# Altium schematic sheet IMX7S_PMIC.SchDoc
size A3
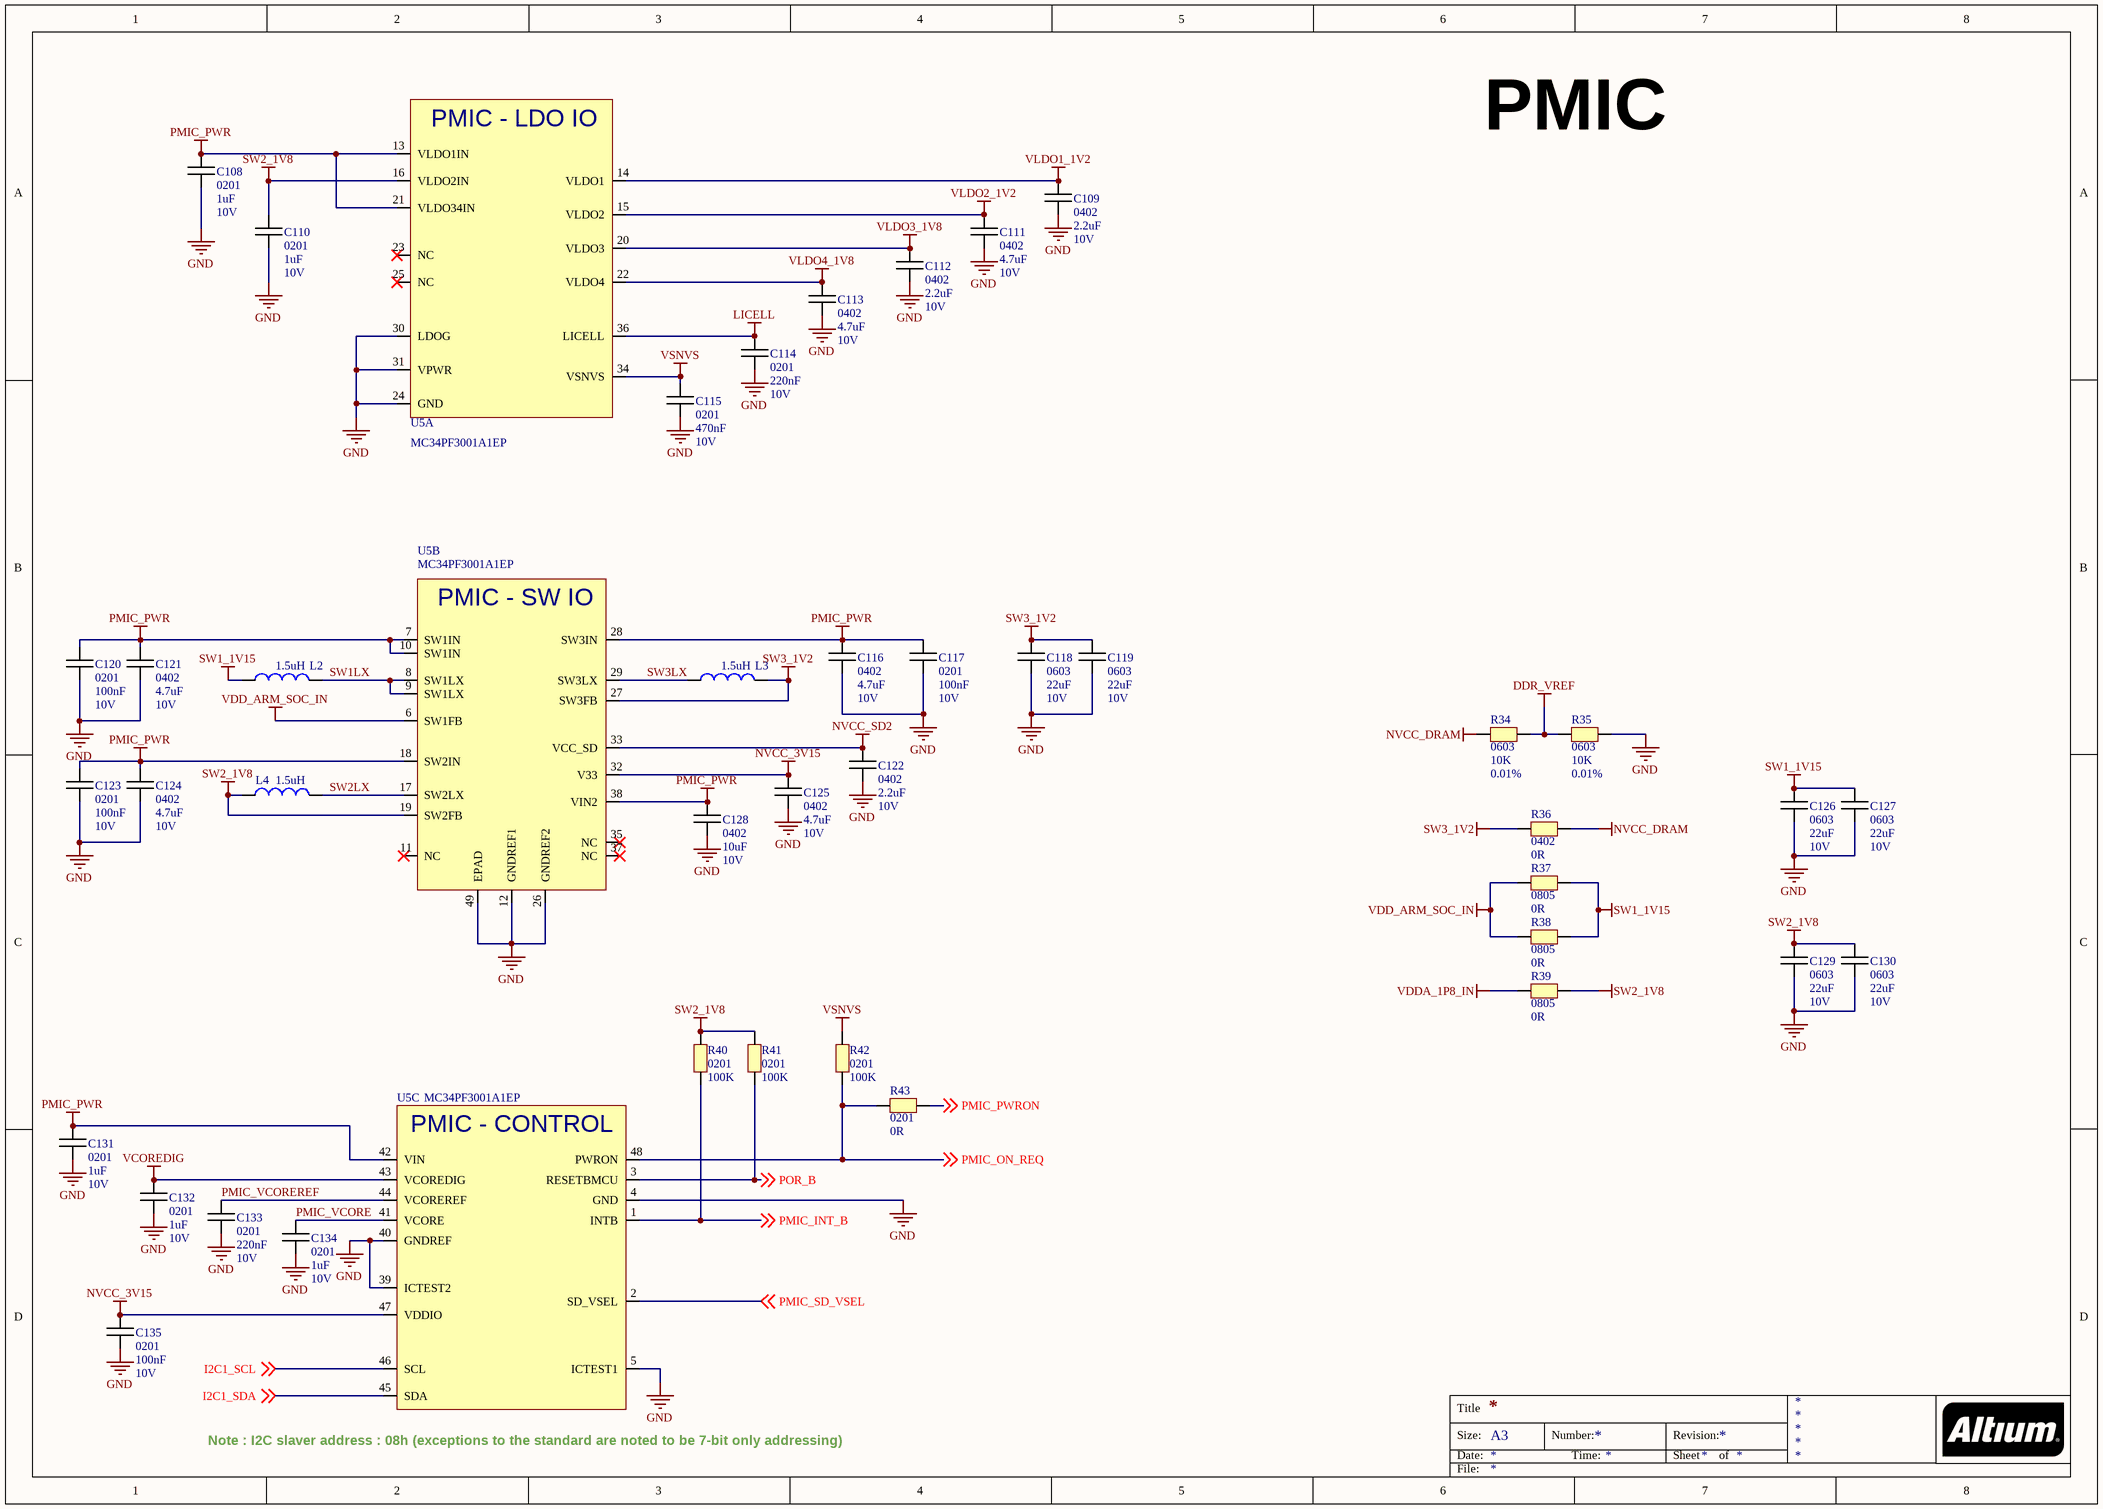
[diagram p0: IMX7S_PMIC.SchDoc]

## Parts
C108  value 1uF  PACKAGE: 0201  VOLTAGE: 10V  [C0201]  (hidden comment: C0201)
C109  value 2.2uF  PACKAGE: 0402  VOLTAGE: 10V  [C0402]  (hidden comment: C0402)
C110  value 1uF  PACKAGE: 0201  VOLTAGE: 10V  [C0201]  (hidden comment: C0201)
C111  value 4.7uF  PACKAGE: 0402  VOLTAGE: 10V  [C0402]  (hidden comment: C0402)
C112  value 2.2uF  PACKAGE: 0402  VOLTAGE: 10V  [C0402]  (hidden comment: C0402)
C113  value 4.7uF  PACKAGE: 0402  VOLTAGE: 10V  [C0402]  (hidden comment: C0402)
C114  value 220nF  PACKAGE: 0201  VOLTAGE: 10V  [C0201]  (hidden comment: C0201)
C115  value 470nF  PACKAGE: 0201  VOLTAGE: 10V  [C0201]  (hidden comment: C0201)
C116  value 4.7uF  PACKAGE: 0402  VOLTAGE: 10V  [C0402]  (hidden comment: C0402)
C117  value 100nF  PACKAGE: 0201  VOLTAGE: 10V  [C0201]  (hidden comment: C0201)
C118  value 22uF  PACKAGE: 0603  VOLTAGE: 10V  [C0603]  (hidden comment: C0603)
C119  value 22uF  PACKAGE: 0603  VOLTAGE: 10V  [C0603]  (hidden comment: C0603)
C120  value 100nF  PACKAGE: 0201  VOLTAGE: 10V  [C0201]  (hidden comment: C0201)
C121  value 4.7uF  PACKAGE: 0402  VOLTAGE: 10V  [C0402]  (hidden comment: C0402)
C122  value 2.2uF  PACKAGE: 0402  VOLTAGE: 10V  [C0402]  (hidden comment: C0402)
C123  value 100nF  PACKAGE: 0201  VOLTAGE: 10V  [C0201]  (hidden comment: C0201)
C124  value 4.7uF  PACKAGE: 0402  VOLTAGE: 10V  [C0402]  (hidden comment: C0402)
C125  value 4.7uF  PACKAGE: 0402  VOLTAGE: 10V  [C0402]  (hidden comment: C0402)
C126  value 22uF  PACKAGE: 0603  VOLTAGE: 10V  [C0603]  (hidden comment: C0603)
C127  value 22uF  PACKAGE: 0603  VOLTAGE: 10V  [C0603]  (hidden comment: C0603)
C128  value 10uF  PACKAGE: 0402  VOLTAGE: 10V  [C0402]  (hidden comment: C0402)
C129  value 22uF  PACKAGE: 0603  VOLTAGE: 10V  [C0603]  (hidden comment: C0603)
C130  value 22uF  PACKAGE: 0603  VOLTAGE: 10V  [C0603]  (hidden comment: C0603)
C131  value 1uF  PACKAGE: 0201  VOLTAGE: 10V  [C0201]  (hidden comment: C0201)
C132  value 1uF  PACKAGE: 0201  VOLTAGE: 10V  [C0201]  (hidden comment: C0201)
C133  value 220nF  PACKAGE: 0201  VOLTAGE: 10V  [C0201]  (hidden comment: C0201)
C134  value 1uF  PACKAGE: 0201  VOLTAGE: 10V  [C0201]  (hidden comment: C0201)
C135  value 100nF  PACKAGE: 0201  VOLTAGE: 10V  [C0201]  (hidden comment: C0201)
L2  value 1.5uH  [SELF]  (hidden comment: Self)
L3  value 1.5uH  [SELF]  (hidden comment: Self)
L4  value 1.5uH  [SELF]  (hidden comment: Self)
R34  value 10K  PACKAGE: 0603  VOLTAGE: 0.01%  [R0603]  (hidden comment: R0603)
R35  value 10K  PACKAGE: 0603  VOLTAGE: 0.01%  [R0603]  (hidden comment: R0603)
R36  value 0R  PACKAGE: 0402  [R0402]  (hidden comment: R0402)
R37  value 0R  PACKAGE: 0805  [R0805]  (hidden comment: R0805)
R38  value 0R  PACKAGE: 0805  [R0805]  (hidden comment: R0805)
R39  value 0R  PACKAGE: 0805  [R0805]  (hidden comment: R0805)
R40  value 100K  PACKAGE: 0201  [R0201]  (hidden comment: R0201)
R41  value 100K  PACKAGE: 0201  [R0201]  (hidden comment: R0201)
R42  value 100K  PACKAGE: 0201  [R0201]  (hidden comment: R0201)
R43  value 0R  PACKAGE: 0201  [R0201]  (hidden comment: R0201)
U5  MC34PF3001A1EP  [QFN48]  (parts A,B,C of 3)

## Nets
DDR_VREF: R34.2 R35.1
GND: C108.1 C109.1 C110.1 C111.1 C112.1 C113.1 C114.1 C115.1 C116.1 C117.1 C118.1 C119.1 C120.1 C121.1 C122.1 C123.1 C124.1 C125.1 C126.1 C127.1 C128.1 C129.1 C130.1 C131.1 C132.1 C133.1 C134.1 C135.1 R35.2 U5.4(GND) U5.5(ICTEST1) U5.12(GNDREF1) U5.24(GND) U5.26(GNDREF2) U5.30(LDOG) U5.31(VPWR) U5.39(ICTEST2) U5.40(GNDREF) U5.49(EPAD)
LICELL: C114.2 U5.36(LICELL)
NVCC_3V15: C125.2 C135.2 U5.32(V33) U5.47(VDDIO)
NVCC_DRAM: R34.1 R36.2
NVCC_SD2: C122.2 U5.33(VCC_SD)
PMIC_PWR: C108.2 C116.2 C117.2 C120.2 C121.2 C123.2 C124.2 C128.2 C131.2 U5.7(SW1IN) U5.10(SW1IN) U5.13(VLDO1IN) U5.18(SW2IN) U5.21(VLDO34IN) U5.28(SW3IN) U5.38(VIN2) U5.42(VIN)
SW1_1V15: C126.2 C127.2 L2.1 R37.2 R38.2
SW2_1V8: C110.2 C129.2 C130.2 L4.1 R39.2 R40.2 R41.2 U5.16(VLDO2IN) U5.19(SW2FB)
SW3_1V2: C118.2 C119.2 L3.2 R36.1 U5.27(SW3FB)
VCOREDIG: C132.2 U5.43(VCOREDIG)
VDD_ARM_SOC_IN: R37.1 R38.1 U5.6(SW1FB)
VDDA_1P8_IN: R39.1
VLDO1_1V2: C109.2 U5.14(VLDO1)
VLDO2_1V2: C111.2 U5.15(VLDO2)
VLDO3_1V8: C112.2 U5.20(VLDO3)
VLDO4_1V8: C113.2 U5.22(VLDO4)
VSNVS: C115.2 R42.2 U5.34(VSNVS)
I2C1_SCL: U5.46(SCL) ; off-sheet I2C1_SCL
I2C1_SDA: U5.45(SDA) ; off-sheet I2C1_SDA
PMIC_INT_B: R40.1 U5.1(INTB) ; off-sheet PMIC_INT_B
PMIC_ON_REQ: R42.1 R43.2 U5.48(PWRON) ; off-sheet PMIC_ON_REQ
PMIC_PWRON: R43.1 ; off-sheet PMIC_PWRON
PMIC_SD_VSEL: U5.2(SD_VSEL) ; off-sheet PMIC_SD_VSEL
PMIC_VCORE: C134.2 U5.41(VCORE)
PMIC_VCOREREF: C133.2 U5.44(VCOREREF)
POR_B: R41.1 U5.3(RESETBMCU) ; off-sheet POR_B
SW1LX: L2.2 U5.8(SW1LX) U5.9(SW1LX)
SW2LX: L4.2 U5.17(SW2LX)
SW3LX: L3.1 U5.29(SW3LX)

Not connected (* = marked no-connect by the designer): U5 11(NC)* 23(NC)* 25(NC)* 35(NC)* 37(NC)*

## Notes on the sheet
- PMIC
- (near U5) Note : I2C slaver address : 08h (exceptions to the standard are noted to be 7-bit only addressing)
- Title
- Size:
- Date:
- A3
- Number:
- Time:
- Revision:
- Sheet
- of
- File:
- (in symbol MC34PF3001A1EP, part A) PMIC - LDO IO
- (in symbol MC34PF3001A1EP, part B) PMIC - SW IO
- (in symbol MC34PF3001A1EP, part C) PMIC - CONTROL

## Library data of the parts
C108 C110 C131 C132 C134 = C0201: Manufacturer 1: Murata; Manufacturer Part Number 1: GRM033R60J105MEA2D; Description: CAP CER 1UF 6.3V X5R 0201; Tolerance: 20%; Voltage Rating: 6.3V; Dielectric: X5R; Supplier 1: Farnell; Supplier Part Number 1: 2666353; Stock 1: 165000; Pricing 1: 15000=0,01430, 75000=0,01240 (EUR); RoHS: Yes; Mount: Surface Mount; Case/Package: 0201; Weight: 1.2E-05oz; Case Code (Imperial): 0201; Case Code (Metric): 0603; Min Operating Temperature: -55°C; Max Operating Temperature: 85°C; Package Quantity: 1; Packaging: Cut Tape; Capacitance: 1uF; Voltage Rating (DC): 6.3V; Termination: SMD/SMT; Length: 0.6mm; Height: 0.3mm; Width: 0.3mm; Depth: 0.3mm; Thickness: 300um; REACH SVHC: No SVHC; Lead Free: Lead Free; ComponentLink1URL: https://datasheet.ciiva.com/18699/grm033r60j105mea2-02-18699520.pdf?src-supplier=Digi-Key; ComponentLink1Description: https://datasheet.ciiva.com/18699/grm033r60j105mea2-02-18699520.pdf?src-supplier=Digi-Key; ComponentLink2URL: https://datasheet.ciiva.com/24218/c02e-24218376.pdf?src-supplier=Mouser; ComponentLink2Description: https://datasheet.ciiva.com/24218/c02e-24218376.pdf?src-supplier=Mouser; ComponentLink3URL: https://datasheet.ciiva.com/18699/partnumbering-e-01-18699519.pdf?src-supplier=Digi-Key; ComponentLink3Description: https://datasheet.ciiva.com/18699/partnumbering-e-01-18699519.pdf?src-supplier=Digi-Key
C109 C112 C122 = C0402: Manufacturer 1: Wurth Electronics; Manufacturer Part Number 1: 885012105013; Tolerance: 20%; Supplier 1: Farnell; Supplier Part Number 1: 2533930; Stock 1: 11802; Pricing 1: 10=0,21600, 100=0,14100, 500=0,10600, 2500=0,09320, 5000=0,07880, 10000=0,07420, 50000=0,06950 (EUR); RoHS: Yes; Mount: Surface Mount; Case/Package: 0402; Case Code (Metric): 1005; Case Code (Imperial): 0402; Min Operating Temperature: -55°C; Max Operating Temperature: 85°C; Packaging: Tape and Reel; Capacitance: 2.2uF; Voltage Rating: 10V; Length: 0.039inch; Width: 0.02inch; Thickness: 0.022inch; ComponentLink1URL: http://www.farnell.com/datasheets/2031748.pdf?src-supplier=Farnell; ComponentLink1Description: http://www.farnell.com/datasheets/2031748.pdf?src-supplier=Farnell; ComponentLink2URL: https://katalog.we-online.de/pbs/datasheet/885012105013.pdf?src-supplier=Digi-Key; ComponentLink2Description: https://katalog.we-online.de/pbs/datasheet/885012105013.pdf?src-supplier=Digi-Key
C111 C113 C116 C121 C124 C125 = C0402: Manufacturer 1: Murata; Manufacturer Part Number 1: GRM155R61A475MEAAD; Supplier 1: Farnell; Supplier Part Number 1: 2688503; Stock 1: 566816; Pricing 1: 10=0,19300, 100=0,08330, 500=0,05910, 2500=0,04130, 5000=0,03540, 10000=0,02750, 50000=0,02700 (EUR); Case/Package: 0402; ComponentLink1URL: http://www.farnell.com/datasheets/2189109.pdf?src-supplier=Farnell; ComponentLink1Description: http://www.farnell.com/datasheets/2189109.pdf?src-supplier=Farnell; ComponentLink2URL: https://search.murata.co.jp/Ceramy/image/img/A01X/G101/ENG/GRM155R61A475MEAA-01.pdf?src-supplier=Digi-Key; ComponentLink2Description: https://search.murata.co.jp/Ceramy/image/img/A01X/G101/ENG/GRM155R61A475MEAA-01.pdf?src-supplier=Digi-Key; ComponentLink3URL: http://datasheet.octopart.com/GRM155R61A475MEAAD-Murata-datasheet-68589269.pdf?src-supplier=Newark; ComponentLink3Description: http://datasheet.octopart.com/GRM155R61A475MEAAD-Murata-datasheet-68589269.pdf?src-supplier=Newark; ComponentLink4URL: http://datasheet.octopart.com/GRM155R61A475MEAAD-Murata-datasheet-8819587.pdf; ComponentLink4Description: http://datasheet.octopart.com/GRM155R61A475MEAAD-Murata-datasheet-8819587.pdf; ComponentLink5URL: http://datasheet.octopart.com/GRM155R61A475MEAAD-Murata-datasheet-10025737.pdf; ComponentLink5Description: http://datasheet.octopart.com/GRM155R61A475MEAAD-Murata-datasheet-10025737.pdf; ComponentLink6URL: http://datasheet.octopart.com/GRM155R61A475MEAAD-Murata-datasheet-11978611.pdf; ComponentLink6Description: http://datasheet.octopart.com/GRM155R61A475MEAAD-Murata-datasheet-11978611.pdf; ComponentLink7URL: http://datasheet.octopart.com/GRM155R61A475MEAAD-Murata-datasheet-12510076.pdf; ComponentLink7Description: http://datasheet.octopart.com/GRM155R61A475MEAAD-Murata-datasheet-12510076.pdf; ComponentLink8URL: http://datasheet.octopart.com/GRM155R61A475MEAAD-Murata-datasheet-12515295.pdf; ComponentLink8Description: http://datasheet.octopart.com/GRM155R61A475MEAAD-Murata-datasheet-12515295.pdf
C114 C133 = C0201: Manufacturer 1: Murata; Manufacturer Part Number 1: GRM033R61A224KE90D; Tolerance: 10%; Dielectric: X5R; Supplier 1: Farnell; Supplier Part Number 1: 2990687; Stock 1: 4290; Pricing 1: 10=0,04270, 100=0,02370, 500=0,01800, 2500=0,01350, 7500=0,00950, 15000=0,00760, 75000=0,00630 (EUR); RoHS: Yes; Mount: Surface Mount; Case/Package: 0201; Case Code (Metric): 0603; Case Code (Imperial): 0201; Min Operating Temperature: -55°C; Max Operating Temperature: 85°C; Capacitance: 220nF; Voltage Rating (DC): 10V; Packaging: Tape and Reel; Voltage Rating: 10V; Length: 0.024inch; Width: 0.012inch; Thickness: 0.013inch; ComponentLink1URL: http://www.mouser.com/ds/2/281/c02e-2905.pdf?src-supplier=Mouser; ComponentLink1Description: http://www.mouser.com/ds/2/281/c02e-2905.pdf?src-supplier=Mouser; ComponentLink2URL: http://search.murata.co.jp/Ceramy/image/img/A01X/G101/ENG/GRM033R61A224KE90-01.pdf?src-supplier=Digi-Key; ComponentLink2Description: http://search.murata.co.jp/Ceramy/image/img/A01X/G101/ENG/GRM033R61A224KE90-01.pdf?src-supplier=Digi-Key
C117 C120 C123 C135 = C0201: Manufacturer 1: Murata; Manufacturer Part Number 1: GRM033R61A104KE15D; Tolerance: 10%; Dielectric: X5R; Supplier 1: Farnell; Supplier Part Number 1: 2666355; Stock 1: 2430000; Pricing 1: 15000=0,00510, 75000=0,00310 (EUR); RoHS: Yes; Mount: Surface Mount; Case/Package: 0201; Weight: 6E-06oz; Case Code (Metric): 0603; Case Code (Imperial): 0201; Min Operating Temperature: -55°C; Max Operating Temperature: 85°C; Packaging: Tape and Reel; Capacitance: 100nF; Voltage Rating: 10V; Package Quantity: 1; Voltage Rating (DC): 10V; Termination: SMD/SMT; Length: 0.6mm; Height: 0.3mm; Width: 0.012inch; Thickness: 0.013inch; Depth: 0.3mm; Radiation Hardening: No; REACH SVHC: No SVHC; Lead Free: Lead Free; ComponentLink1URL: https://datasheet.ciiva.com/26843/getdatasheetpartid-308656-26843739.pdf?src-supplier=Verical; ComponentLink1Description: https://datasheet.ciiva.com/26843/getdatasheetpartid-308656-26843739.pdf?src-supplier=Verical; ComponentLink2URL: https://datasheet.ciiva.com/5413/product-5413117.pdf?src-supplier=Mouser; ComponentLink2Description: https://datasheet.ciiva.com/5413/product-5413117.pdf?src-supplier=Mouser; ComponentLink3URL: https://datasheet.ciiva.com/6256/partnumbering-e-01-6256406.pdf?src-supplier=Digi-Key; ComponentLink3Description: https://datasheet.ciiva.com/6256/partnumbering-e-01-6256406.pdf?src-supplier=Digi-Key; ComponentLink4URL: https://datasheet.ciiva.com/6256/partnumbering-e-01-6256408.pdf?src-supplier=Digi-Key; ComponentLink4Description: https://datasheet.ciiva.com/6256/partnumbering-e-01-6256408.pdf?src-supplier=Digi-Key; ComponentLink5URL: https://datasheet.ciiva.com/6256/partnumbering-e-01-6256407.pdf?src-supplier=Digi-Key; ComponentLink5Description: https://datasheet.ciiva.com/6256/partnumbering-e-01-6256407.pdf?src-supplier=Digi-Key
C118 C119 C126 C127 C129 C130 = C0603: Manufacturer 1: Murata; Manufacturer Part Number 1: GRM188R61A226ME15D; Description: CAP, MLCC, X5R, 22UF, 10V, 0603; Material: Ceramic; Tolerance: 20%; Dielectric: X5R; Supplier 1: Farnell; Supplier Part Number 1: 2666496; Stock 1: 2740000; Pricing 1: 4000=0,05170 (EUR); RoHS: Yes; Mount: Surface Mount; Case/Package: 0603; Weight: 0.000222oz; Case Code (Metric): 1608; Case Code (Imperial): 0603; Min Operating Temperature: -55°C; Max Operating Temperature: 85°C; Packaging: Tape and Reel; Package Quantity: 4000; Capacitance: 22uF; Voltage Rating: 10V; Termination: SMD/SMT; Voltage Rating (DC): 10V; Length: 1.6mm; Height: 0.8mm; Width: 0.8mm; Thickness: 0.039inch; Depth: 0.8mm; REACH SVHC: No SVHC; Lead Free: Lead Free; ComponentLink1URL: https://datasheet.ciiva.com/46444/1769893-46444975.pdf?src-supplier=Element14; ComponentLink1Description: https://datasheet.ciiva.com/46444/1769893-46444975.pdf?src-supplier=Element14
C128 = C0402: Manufacturer 1: Murata; Manufacturer Part Number 1: GRM155R60J106ME44D; Tolerance: 20%; Voltage Rating: 6.3V; Dielectric: X5R; Supplier 1: Farnell; Supplier Part Number 1: 2666402; Stock 1: 2120000; Pricing 1: 10000=0,05500, 50000=0,04130 (EUR); RoHS: Yes; Mount: Surface Mount; Case/Package: 0402; Case Code (Imperial): 0402; Case Code (Metric): 1005; Min Operating Temperature: -55°C; Max Operating Temperature: 85°C; Packaging: Tape and Reel; Package Quantity: 10000; Capacitance: 10uF; Voltage Rating (DC): 6.3V; Termination: SMD/SMT; Length: 1mm; Height: 0.5mm; Width: 0.5mm; Thickness: 0.022inch; Depth: 0.5mm; REACH SVHC: No SVHC; Lead Free: Lead Free; ComponentLink1URL: http://www.farnell.com/datasheets/1666664.pdf?src-supplier=Farnell; ComponentLink1Description: http://www.farnell.com/datasheets/1666664.pdf?src-supplier=Farnell; ComponentLink2URL: http://components.arrow.com/part/dataview/50476202S8987292N2606?src-supplier=Arrow; ComponentLink2Description: http://components.arrow.com/part/dataview/50476202S8987292N2606?src-supplier=Arrow; ComponentLink3URL: http://uk.rs-online.com/webdocs/13b3/0900766b813b3e5a.pdf?src-supplier=RSComponents; ComponentLink3Description: http://uk.rs-online.com/webdocs/13b3/0900766b813b3e5a.pdf?src-supplier=RSComponents; ComponentLink4URL: http://www.mouser.com/ds/2/281/c02e-2905.pdf?src-supplier=Mouser; ComponentLink4Description: http://www.mouser.com/ds/2/281/c02e-2905.pdf?src-supplier=Mouser; ComponentLink5URL: http://www.farnell.com/datasheets/1889704.pdf?src-supplier=Farnell; ComponentLink5Description: http://www.farnell.com/datasheets/1889704.pdf?src-supplier=Farnell; ComponentLink6URL: http://components.arrow.com/part/dataview/0323_07121522?src-supplier=Arrow+Europe; ComponentLink6Description: http://components.arrow.com/part/dataview/0323_07121522?src-supplier=Arrow+Europe; ComponentLink7URL: http://www.farnell.com/datasheets/1889704.pdf?src-supplier=Element14; ComponentLink7Description: http://www.farnell.com/datasheets/1889704.pdf?src-supplier=Element14; ComponentLink8URL: http://www.murata.com/en-global/about/newsroom/news/product/capacitor/2010/0510?src-supplier=Avnet; ComponentLink8Description: http://www.murata.com/en-global/about/newsroom/news/product/capacitor/2010/0510?src-supplier=Avnet; ComponentLink9URL: https://www.murata.com/~/media/webrenewal/support/library/catalog/products/capacitor/mlcc/c02e.ashx?la=en-us&src-supplier=Digi-Key; ComponentLink9Description: https://www.murata.com/~/media/webrenewal/support/library/catalog/products/capacitor/mlcc/c02e.ashx?la=en-us&src-supplier=Digi-Key; ComponentLink10URL: http://www.farnell.com/datasheets/1889704.pdf?src-supplier=Newark; ComponentLink10Description: http://www.farnell.com/datasheets/1889704.pdf?src-supplier=Newark
L2-L4 = Self: Manufacturer 1: Bourns; Manufacturer Part Number 1: SRN8040TA-1R5Y; RMS Current (Irms): 8A; Saturation Current: 11.5A; DC Resistance (DCR): 10mR; Inductance Tolerance: 30%; Supplier 1: Farnell; Supplier Part Number 1: 2616909; Stock 1: 1129; Pricing 1: 1=0,16900 (EUR); RoHS: No; Mount: Surface Mount; Inductance: 1.5uH; Packaging: Cut Tape; REACH SVHC: No SVHC; ComponentLink1URL: https://www.bourns.com/docs/Product-Datasheets/SRN8040TA.pdf?src-supplier=Digi-Key; ComponentLink1Description: https://www.bourns.com/docs/Product-Datasheets/SRN8040TA.pdf?src-supplier=Digi-Key; ComponentLink2URL: http://www.farnell.com/datasheets/2113224.pdf?src-supplier=Element14; ComponentLink2Description: http://www.farnell.com/datasheets/2113224.pdf?src-supplier=Element14
R34 R35 = R0603: Manufacturer 1: Multicomp; Manufacturer Part Number 1: MCTF0603TTX1002; Description: GLOVE, NITROTOUGH, M, N230 - More Details; Resistance: 10kR; Power Rating: 62.5mW; Voltage Rating: 50V; Temperature Coefficient: 50ppm/°C; Supplier 1: Farnell; Supplier Part Number 1: 2395986; Stock 1: 2147; Pricing 1: 1=1,60000, 5=1,37000, 10=1,07000, 20=0,86100, 40=0,72000, 100=0,61800, 500=0,44300, 1000=0,40300 (EUR); RoHS: Yes; Case/Package: 0603; Number of Pins: 2; Case Code (Metric): 1608; Case Code (Imperial): 0603; Packaging: Cut Tape; Tolerance: 0.01%; Composition: Thin Film; Voltage Rating (DC): 50V; REACH SVHC: Unknown; ComponentLink1URL: https://datasheet.ciiva.com/6058/ta-1007-6058950.pdf?src-supplier=Farnell; ComponentLink1Description: https://datasheet.ciiva.com/6058/ta-1007-6058950.pdf?src-supplier=Farnell; ComponentLink2URL: https://datasheet.ciiva.com/7881/674184-7881755.pdf?src-supplier=Element14; ComponentLink2Description: https://datasheet.ciiva.com/7881/674184-7881755.pdf?src-supplier=Element14
R36 = R0402: Manufacturer 1: Multicomp; Manufacturer Part Number 1: MCSR04X000PTL; VOLTAGE: 0V; Description: MULTICOMP - MCSR04X000 PTL - RES, 0R0, 0.0625W, 0402, CERAMIC; Power Rating: 62.5mW; Voltage Rating: 50V; Resistance: 0mR; Temperature Coefficient: 400ppm/°C; Supplier 1: Farnell; Supplier Part Number 1: 2073956; Stock 1: 1770; Pricing 1: 10=0,00730, 100=0,00640, 500=0,00540, 2500=0,00390, 5000=0,00320, 10000=0,00260, 50000=0,00200, 100000=0,00160 (EUR); RoHS: Yes; Case/Package: 0402; Case Code (Metric): 1005; Case Code (Imperial): 0402; Composition: Ceramic; Packaging: Cut Tape; Voltage Rating (DC): 50V; REACH SVHC: No SVHC; ComponentLink1URL: https://datasheet.ciiva.com/7777/1716710-7777064.pdf?src-supplier=Element14; ComponentLink1Description: https://datasheet.ciiva.com/7777/1716710-7777064.pdf?src-supplier=Element14
R37-R39 = R0805: Manufacturer 1: Multicomp; Manufacturer Part Number 1: MC0.1W08050R; VOLTAGE: 0V; Description: MULTICOMP - MC01W08050R - RES, 0R0, 0.1W, , THICK FILM; Voltage Rating: 150V; Resistance: 0mR; Power Rating: 100mW; Temperature Coefficient: 200ppm/°C; Supplier 1: Farnell; Supplier Part Number 1: 9333681; Stock 1: 1031035; Pricing 1: 10=0,007600, 100=0,006600, 500=0,005600, 1000=0,005300, 2500=0,003300, 5000=0,002700, 25000=0,002100, 50000=0,002000 (GBP); RoHS: Yes; Case/Package: 0805; Number of Pins: 2; Case Code (Metric): 2012; Case Code (Imperial): 0805; Min Operating Temperature: -55°C; Max Operating Temperature: 155°C; Packaging: Cut Tape; Voltage Rating (DC): 150V; Composition: Thick Film; Width: 1.25mm; REACH SVHC: No SVHC; ComponentLink1URL: https://datasheet.ciiva.com/7776/1716700-7776709.pdf?src-supplier=Element14; ComponentLink1Description: https://datasheet.ciiva.com/7776/1716700-7776709.pdf?src-supplier=Element14; ComponentLink2URL: https://datasheet.ciiva.com/7776/1716700-7776710.pdf?src-supplier=Element14; ComponentLink2Description: https://datasheet.ciiva.com/7776/1716700-7776710.pdf?src-supplier=Element14
R40-R42 = R0201: Manufacturer 1: Multicomp; Manufacturer Part Number 1: MCWR02X1003FAL; VOLTAGE: 0V; Description: MULTICOMP - MCWR02X1003FAL - RES, 100K, 1%, 0.05W, THICK FILM; Resistance: 100kR; Voltage Rating: 25V; Power Rating: 50mW; Tolerance: 1%; Temperature Coefficient: 100ppm/°C; Supplier 1: Farnell; Supplier Part Number 1: 2447751; Stock 1: 626; Pricing 1: 10=0,01110, 100=0,00670, 500=0,00470, 2500=0,00370, 7500=0,00300 (EUR); RoHS: No; Case/Package: 0201; Case Code (Metric): 0603; Case Code (Imperial): 0201; Packaging: Cut Tape; Composition: Thick Film; Voltage Rating (DC): 25V; REACH SVHC: No SVHC; ComponentLink1URL: http://www.farnell.com/datasheets/2360050.pdf?src-supplier=Farnell; ComponentLink1Description: http://www.farnell.com/datasheets/2360050.pdf?src-supplier=Farnell; ComponentLink2URL: http://www.farnell.com/datasheets/1849611.pdf?src-supplier=Element14; ComponentLink2Description: http://www.farnell.com/datasheets/1849611.pdf?src-supplier=Element14
R43 = R0201: Manufacturer 1: Multicomp; Manufacturer Part Number 1: MCRE000086; VOLTAGE: 0V; Description: MULTICOMP - MCRE000086 - RES, 0R0, 1%, 0.05W, 0201, THICK FILM; Voltage Rating (DC): 25V; Resistance: 0mR; Tolerance: 1%; Power Rating: 50mW; Temperature Coefficient: 200ppm/°C; Supplier 1: Farnell; Supplier Part Number 1: 1711553; Stock 1: 97280; Pricing 1: 10=0,01820, 100=0,01090, 500=0,00780, 2500=0,00610, 5000=0,00490 (EUR); RoHS: Yes; Case/Package: SMD/SMT; Case Code (Metric): 0603; Case Code (Imperial): 0201; Min Operating Temperature: -55°C; Max Operating Temperature: 125°C; Packaging: Cut Tape; Voltage Rating: 25V; Composition: Thick Film; Width: 0.6mm; REACH SVHC: No SVHC; ComponentLink1URL: https://datasheet.ciiva.com/7777/1662352-7777045.pdf?src-supplier=Element14; ComponentLink1Description: https://datasheet.ciiva.com/7777/1662352-7777045.pdf?src-supplier=Element14
U5 = MC34PF3001A1EP: Supplier 1: Mouser; Supplier Part Number 1: 841-MC34PF3001A1EP